# EAGLE design ascender_board (EAGLE 6.6.0)
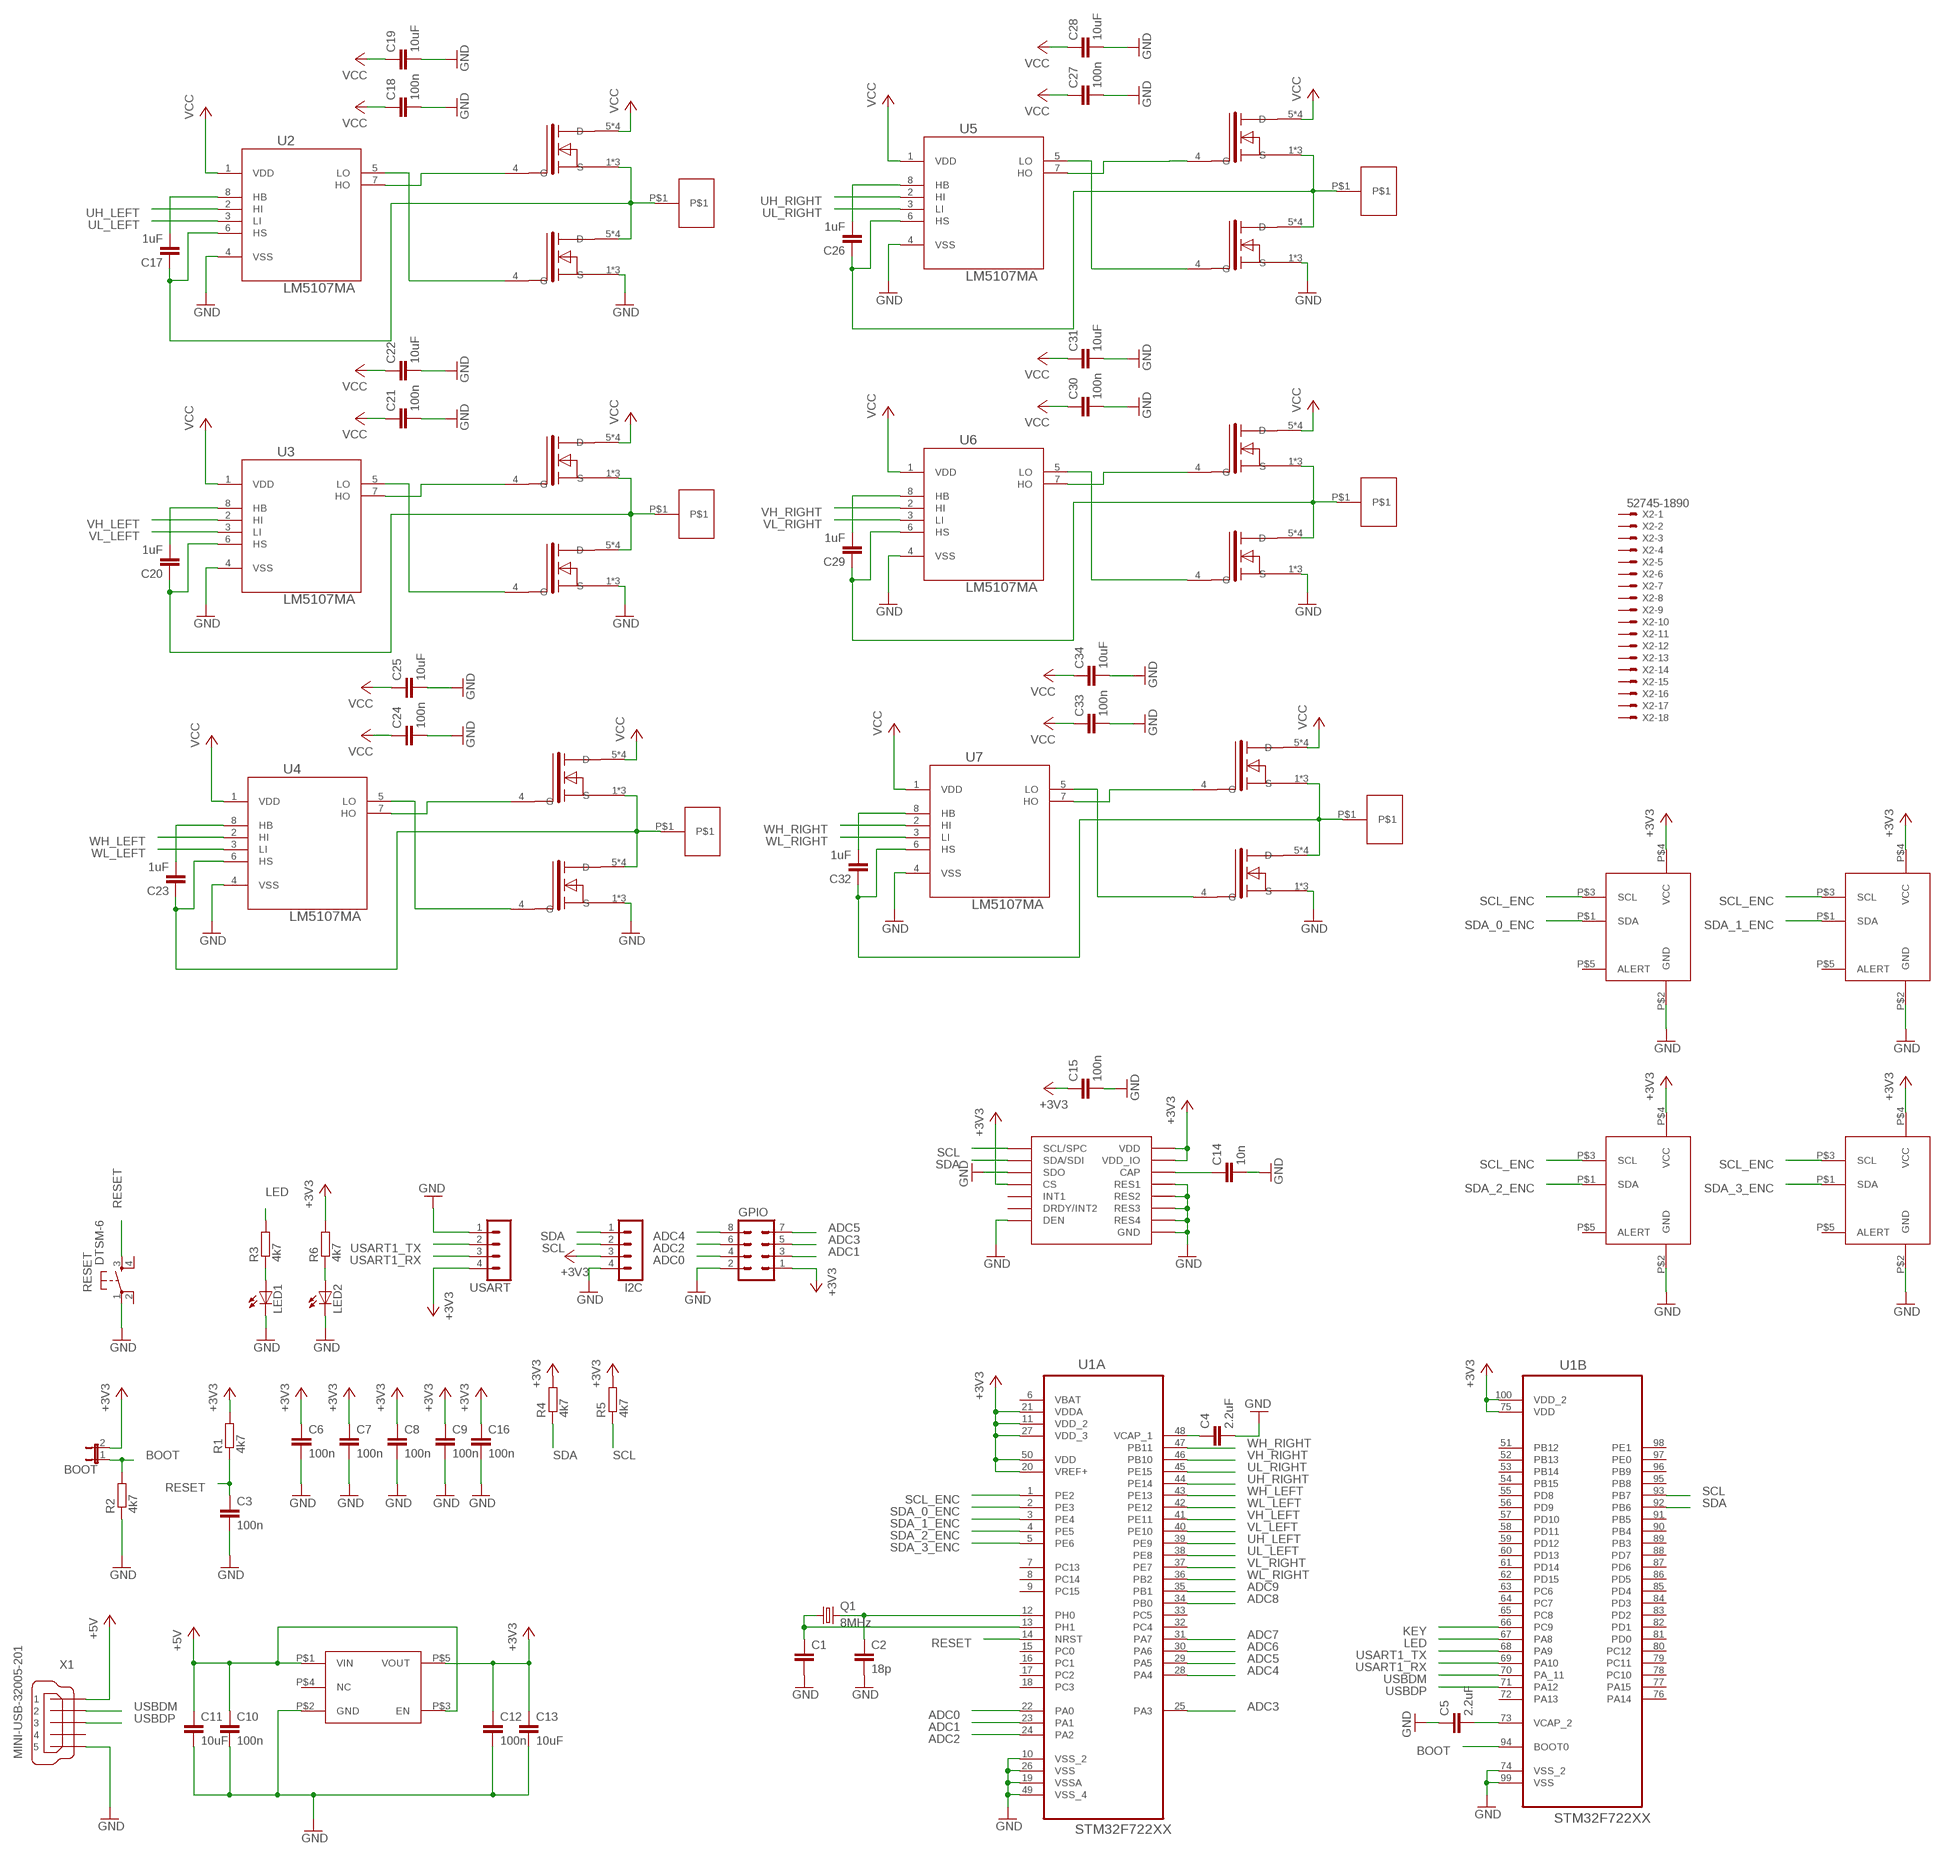
[diagram p0: schematic, sheet 1]

## Parts
BOOT  JP1E  [JP1]
C1  C-EUC0805  [C0805]
C2  18p  C-EUC0805  [C0805]
C3  100n  C-EUC0805  [C0805]
C4  2.2uF  C-EUC0805  [C0805]
C5  2.2uF  C-EUC0805  [C0805]
C6  100n  C-EUC0805  [C0805]
C7  100n  C-EUC0805  [C0805]
C8  100n  C-EUC0805  [C0805]
C9  100n  C-EUC0805  [C0805]
C10  100n  C-EUC0805  [C0805]
C11  10uF  C-EUC0805  [C0805]
C12  100n  C-EUC0805  [C0805]
C13  10uF  C-EUC0805  [C0805]
C14  10n  C-EUC0805  [C0805]
C15  100n  C-EUC0805  [C0805]
C16  100n  C-EUC0805  [C0805]
C17  1uF  C-EUC0805  [C0805]
C18  100n  C-EUC0805  [C0805]
C19  10uF  C-EUC0805  [C0805]
C20  1uF  C-EUC0805  [C0805]
C21  100n  C-EUC0805  [C0805]
C22  10uF  C-EUC0805  [C0805]
C23  1uF  C-EUC0805  [C0805]
C24  100n  C-EUC0805  [C0805]
C25  10uF  C-EUC0805  [C0805]
C26  1uF  C-EUC0805  [C0805]
C27  100n  C-EUC0805  [C0805]
C28  10uF  C-EUC0805  [C0805]
C29  1uF  C-EUC0805  [C0805]
C30  100n  C-EUC0805  [C0805]
C31  10uF  C-EUC0805  [C0805]
C32  1uF  C-EUC0805  [C0805]
C33  100n  C-EUC0805  [C0805]
C34  10uF  C-EUC0805  [C0805]
GPIO  MA04-2  [MA04-2]
I2C  MA04-1  [MA04-1]
LED1  LEDCHIPLED_1206  [CHIPLED_1206]
LED2  LEDCHIPLED_1206  [CHIPLED_1206]
Q1  8MHz  CRYSTALCTS406  [CTS406]
R1  4k7  R-EU_M0805  [M0805]
R2  4k7  R-EU_M0805  [M0805]
R3  4k7  R-EU_M0805  [M0805]
R4  4k7  R-EU_M0805  [M0805]
R5  4k7  R-EU_M0805  [M0805]
R6  4k7  R-EU_M0805  [M0805]
RESET  DTSM-6  [DTSM-6]
U1  STM32F722XX  [QFP50P1600X1600X160-100N]
U2  LM5107MA  [SOIC127P620X175-8N]
U3  LM5107MA  [SOIC127P620X175-8N]
U4  LM5107MA  [SOIC127P620X175-8N]
U5  LM5107MA  [SOIC127P620X175-8N]
U6  LM5107MA  [SOIC127P620X175-8N]
U7  LM5107MA  [SOIC127P620X175-8N]
U$1  MIC5504-3.3Y  [SOT23-5]
U$2  ST_L3GD20H  [ST_LGA16L]
U$4  IRFH7004  [PQFN5X6]
U$5  IRFH7004  [PQFN5X6]
U$6  BLDC_MOTOR_PIN  [BLDC_MOTOR_PIN]
U$7  IRFH7004  [PQFN5X6]
U$8  IRFH7004  [PQFN5X6]
U$9  BLDC_MOTOR_PIN  [BLDC_MOTOR_PIN]
U$10  IRFH7004  [PQFN5X6]
U$11  IRFH7004  [PQFN5X6]
U$12  BLDC_MOTOR_PIN  [BLDC_MOTOR_PIN]
U$13  IRFH7004  [PQFN5X6]
U$14  IRFH7004  [PQFN5X6]
U$15  BLDC_MOTOR_PIN  [BLDC_MOTOR_PIN]
U$16  IRFH7004  [PQFN5X6]
U$17  IRFH7004  [PQFN5X6]
U$18  BLDC_MOTOR_PIN  [BLDC_MOTOR_PIN]
U$19  IRFH7004  [PQFN5X6]
U$20  IRFH7004  [PQFN5X6]
U$21  BLDC_MOTOR_PIN  [BLDC_MOTOR_PIN]
U$22  SI7210  [SOT23-5]
U$23  SI7210  [SOT23-5]
U$24  SI7210  [SOT23-5]
U$25  SI7210  [SOT23-5]
USART  MA04-1  [MA04-1]
X1  MINI-USB-32005-201  [32005-201]
X2  52745-1890  [52745-1890]

## Nets
+3V3: BOOT.2 C6.1 C7.1 C8.1 C9.1 C12.1 C13.1 C15.1 C16.1 GPIO.1 I2C.3 R1.2 R4.2 R5.2 R6.2 U1.11(A:VDD_2) U1.20(A:VREF+) U1.21(A:VDDA) U1.27(A:VDD_3) U1.50(A:VDD) U1.75(B:VDD) U1.100(B:VDD_2) U$1.P$5(VOUT) U$2.P$1(VDD_IO) U$2.P$5(CS) U$2.P$16(VDD) U$22.P$4(VCC) U$23.P$4(VCC) U$24.P$4(VCC) U$25.P$4(VCC) USART.4
+5V: C10.1 C11.1 U$1.P$1(VIN) U$1.P$3(EN) X1.1
ADC0: GPIO.4 U1.22(A:PA0)
ADC1: GPIO.3 U1.23(A:PA1)
ADC2: GPIO.6 U1.24(A:PA2)
ADC3: GPIO.5 U1.25(A:PA3)
ADC4: GPIO.8 U1.28(A:PA4)
ADC5: GPIO.7 U1.29(A:PA5)
ADC6: U1.30(A:PA6)
ADC7: U1.31(A:PA7)
ADC8: U1.34(A:PB0)
ADC9: U1.35(A:PB1)
BOOT: BOOT.1 R2.2 U1.94(B:BOOT0)
GND: C1.2 C2.2 C3.2 C4.2 C5.1 C6.2 C7.2 C8.2 C9.2 C10.2 C11.2 C12.2 C13.2 C14.2 C15.2 C16.2 C18.2 C19.2 C21.2 C22.2 C24.2 C25.2 C27.2 C28.2 C30.2 C31.2 C33.2 C34.2 GPIO.2 I2C.4 LED1.C LED2.C R2.1 RESET.1 U1.10(A:VSS_2) U1.19(A:VSSA) U1.26(A:VSS) U1.49(A:VSS_4) U1.74(B:VSS_2) U1.99(B:VSS) U2.4(VSS) U3.4(VSS) U4.4(VSS) U5.4(VSS) U6.4(VSS) U7.4(VSS) U$1.P$2(GND) U$2.P$4(SDO) U$2.P$8(DEN) U$2.P$9(RES1) U$2.P$10(RES2) U$2.P$11(RES3) U$2.P$12(GND) U$2.P$13(GND) U$2.P$15(RES4) U$5.1(S) U$5.2(S) U$5.3(S) U$8.1(S) U$8.2(S) U$8.3(S) U$11.1(S) U$11.2(S) U$11.3(S) U$14.1(S) U$14.2(S) U$14.3(S) U$17.1(S) U$17.2(S) U$17.3(S) U$20.1(S) U$20.2(S) U$20.3(S) U$22.P$2(GND) U$23.P$2(GND) U$24.P$2(GND) U$25.P$2(GND) USART.1 X1.5
KEY: U1.66(B:PC9)
LED: R3.2 U1.67(B:PA8)
N$1: C2.1 Q1.3 U1.12(A:PH0)
N$2: C1.1 Q1.1 U1.13(A:PH1)
N$3: C4.1 U1.48(A:VCAP_1)
N$4: C5.2 U1.73(B:VCAP_2)
N$5: LED1.A R3.1
N$6: C14.1 U$2.P$14(CAP)
N$7: U3.5(LO) U$8.4(G)
N$9: U2.5(LO) U$5.4(G)
N$10: U2.7(HO) U$4.4(G)
N$11: LED2.A R6.1
N$14: U3.7(HO) U$7.4(G)
N$15: C17.2 U2.8(HB)
N$16: C17.1 U2.6(HS) U$4.1(S) U$4.2(S) U$4.3(S) U$5.5(D) U$5.6(D) U$5.7(D) U$5.8(D) U$6.P$1
N$18: C20.2 U3.8(HB)
N$19: C20.1 U3.6(HS) U$7.1(S) U$7.2(S) U$7.3(S) U$8.5(D) U$8.6(D) U$8.7(D) U$8.8(D) U$9.P$1
N$20: U4.5(LO) U$11.4(G)
N$22: U4.7(HO) U$10.4(G)
N$24: C23.2 U4.8(HB)
N$25: C23.1 U4.6(HS) U$10.1(S) U$10.2(S) U$10.3(S) U$11.5(D) U$11.6(D) U$11.7(D) U$11.8(D) U$12.P$1
N$27: U5.5(LO) U$14.4(G)
N$28: U5.7(HO) U$13.4(G)
N$30: C26.2 U5.8(HB)
N$31: C26.1 U5.6(HS) U$13.1(S) U$13.2(S) U$13.3(S) U$14.5(D) U$14.6(D) U$14.7(D) U$14.8(D) U$15.P$1
N$32: U6.5(LO) U$17.4(G)
N$34: U6.7(HO) U$16.4(G)
N$36: C29.2 U6.8(HB)
N$37: C29.1 U6.6(HS) U$16.1(S) U$16.2(S) U$16.3(S) U$17.5(D) U$17.6(D) U$17.7(D) U$17.8(D) U$18.P$1
N$38: U7.5(LO) U$20.4(G)
N$40: U7.7(HO) U$19.4(G)
N$42: C32.2 U7.8(HB)
N$43: C32.1 U7.6(HS) U$19.1(S) U$19.2(S) U$19.3(S) U$20.5(D) U$20.6(D) U$20.7(D) U$20.8(D) U$21.P$1
RESET: C3.1 R1.1 RESET.3 U1.14(A:NRST)
SCL: I2C.2 R5.1 U1.93(B:PB7) U$2.P$2(SCL/SPC)
SCL_ENC: U1.1(A:PE2) U$22.P$3(SCL) U$23.P$3(SCL) U$24.P$3(SCL) U$25.P$3(SCL)
SDA: I2C.1 R4.1 U1.92(B:PB6) U$2.P$3(SDA/SDI)
SDA_0_ENC: U1.2(A:PE3) U$22.P$1(SDA)
SDA_1_ENC: U1.3(A:PE4) U$23.P$1(SDA)
SDA_2_ENC: U1.4(A:PE5) U$24.P$1(SDA)
SDA_3_ENC: U1.5(A:PE6) U$25.P$1(SDA)
UH_LEFT: U1.39(A:PE9) U2.2(HI)
UH_RIGHT: U1.44(A:PE14) U5.2(HI)
UL_LEFT: U1.38(A:PE8) U2.3(LI)
UL_RIGHT: U1.45(A:PE15) U5.3(LI)
USART1_RX: U1.69(B:PA10) USART.3
USART1_TX: U1.68(B:PA9) USART.2
USBDM: U1.70(B:PA_11) X1.2
USBDP: U1.71(B:PA12) X1.3
VCC: C18.1 C19.1 C21.1 C22.1 C24.1 C25.1 C27.1 C28.1 C30.1 C31.1 C33.1 C34.1 U2.1(VDD) U3.1(VDD) U4.1(VDD) U5.1(VDD) U6.1(VDD) U7.1(VDD) U$4.5(D) U$4.6(D) U$4.7(D) U$4.8(D) U$7.5(D) U$7.6(D) U$7.7(D) U$7.8(D) U$10.5(D) U$10.6(D) U$10.7(D) U$10.8(D) U$13.5(D) U$13.6(D) U$13.7(D) U$13.8(D) U$16.5(D) U$16.6(D) U$16.7(D) U$16.8(D) U$19.5(D) U$19.6(D) U$19.7(D) U$19.8(D)
VH_LEFT: U1.41(A:PE11) U3.2(HI)
VH_RIGHT: U1.46(A:PB10) U6.2(HI)
VL_LEFT: U1.40(A:PE10) U3.3(LI)
VL_RIGHT: U1.37(A:PE7) U6.3(LI)
WH_LEFT: U1.43(A:PE13) U4.2(HI)
WH_RIGHT: U1.47(A:PB11) U7.2(HI)
WL_LEFT: U1.42(A:PE12) U4.3(LI)
WL_RIGHT: U1.36(A:PB2) U7.3(LI)
Unconnected: RESET.2 RESET.4 U1.7(A:PC13) U1.8(A:PC14) U1.9(A:PC15) U1.15(A:PC0) U1.16(A:PC1) U1.17(A:PC2) U1.18(A:PC3) U1.32(A:PC4) U1.33(A:PC5) U1.51(B:PB12) U1.52(B:PB13) U1.53(B:PB14) U1.54(B:PB15) U1.55(B:PD8) U1.56(B:PD9) U1.57(B:PD10) U1.58(B:PD11) U1.59(B:PD12) U1.60(B:PD13) U1.61(B:PD14) U1.62(B:PD15) U1.63(B:PC6) U1.64(B:PC7) U1.65(B:PC8) U1.72(B:PA13) U1.76(B:PA14) U1.77(B:PA15) U1.78(B:PC10) U1.79(B:PC11) U1.80(B:PC12) U1.81(B:PD0) U1.82(B:PD1) U1.83(B:PD2) U1.84(B:PD3) U1.85(B:PD4) U1.86(B:PD5) U1.87(B:PD6) U1.88(B:PD7) U1.89(B:PB3) U1.90(B:PB4) U1.91(B:PB5) U1.95(B:PB8) U1.96(B:PB9) U1.97(B:PE0) U1.98(B:PE1) U$1.P$4(NC) U$2.P$6(DRDY/INT2) U$2.P$7(INT1) U$22.P$5(ALERT) U$23.P$5(ALERT) U$24.P$5(ALERT) U$25.P$5(ALERT) X1.4 X2.1 X2.2 X2.3 X2.4 X2.5 X2.6 X2.7 X2.8 X2.9 X2.10 X2.11 X2.12 X2.13 X2.14 X2.15 X2.16 X2.17 X2.18

## Power pins joined to a net without a drawn wire
VBAT: U1.6(A:VBAT)

## Library data of the parts
BOOT = jumper:JP1E: JUMPER
C1-C34 = resistor:C-EU: CAPACITOR, European symbol
GPIO = con-lstb:MA04-2: PIN HEADER; OC_FARNELL: unknown; OC_NEWARK: unknown
I2C USART = con-lstb:MA04-1: PIN HEADER; OC_FARNELL: unknown; OC_NEWARK: unknown
LED1 LED2 = my_parts:LED: LED OSRAM: - CHIPLED LG R971, LG N971, LY N971, LG Q971, LY Q971, LO R971, LY R971 LH N974, LH R974 LS Q976, LO Q976, LY Q976 LO Q996 - Hyper CHIPLED LW Q18S LB Q993, LB Q99A, LB R99A - SideLED LS A670, LO A670, LY A670, LG A670, LP A670 LB A673, LV A673, LT A673, LW A673 LH A674 LY A675 LS A676, LA A676, LO A676, LY A676, LW A676 LS A679, LY A679, LG A679 - Hyper Micro SIDELED® LS Y876, LA Y876, LO Y876, LY Y876 LT Y87S - SmartLED LW L88C, LW L88S LB L89C, LB L89S, LG L890 LS L89K, LO L89K, LY L89K LS L896, LA L896, LO L896, LY L896 - TOPLED LS T670, LO T670, LY T670, LG T670, LP T670 LSG T670, LSP T670, LSY T670, LOP T670, LYG T670 LG T671, LOG T671, LSG T671 LB T673, LV T673, LT T673, LW T673 LH T674 LS T676, LA T676, LO T676, LY T676, LB T676, LH T676, LSB T676, LW T676 LB T67C, LV T67C, LT T67C, LS T67K, LO T67K, LY T67K, LW E67C LS E67B, LA E67B, LO E67B, LY E67B, LB E67C, LV E67C, LT E67C LW T67C LS T679, LY T679, LG T679 LS T770, LO T770, LY T770, LG T770, LP T770 LB T773, LV T773, LT T773, LW T773 LH T774 LS E675, LA E675, LY E675, LS T675 LS T776, LA T776, LO T776, LY T776, LB T776 LHGB T686 LT T68C, LB T68C - Hyper Mini TOPLED® LB M676 - Mini TOPLED Santana® LG M470 LS M47K, LO M47K, LY M47K Source: http://www.osram.convergy.de LUXEON: - LUMILED® LXK2-PW12-R00, LXK2-PW12-S00, LXK2-PW14-U00, LXK2-PW14-V00 LXK2-PM12-R00, LXK2-PM12-S00, LXK2-PM14-U00 LXK2-PE12-Q00, LXK2-PE12-R00, LXK2-PE12-S00, LXK2-PE14-T00, LXK2-PE14-U00 LXK2-PB12-K00, LXK2-PB12-L00, LXK2-PB12-M00, LXK2-PB14-N00, LXK2-PB14-P00, LXK2-PB14-Q00 LXK2-PR12-L00, LXK2-PR12-M00, LXK2-PR14-Q00, LXK2-PR14-R00 LXK2-PD12-Q00, LXK2-PD12-R00, LXK2-PD12-S00 LXK2-PH12-R00, LXK2-PH12-S00 LXK2-PL12-P00, LXK2-PL12-Q00, LXK2-PL12-R00 Source: www.luxeon.com KINGBRIGHT: KA-3528ASYC Source: www.kingbright.com
Q1 = crystal:CRYSTAL: CRYSTAL; OC_FARNELL: unknown; OC_NEWARK: unknown
R1-R6 = resistor:R-EU_: RESISTOR, European symbol
RESET = switch-tact:DTSM-6
U1 = stm32:STM32F722XX: IC, MCU, 32BIT, 512K FLASH, 100LQFP; MPN: STM32F407VET6; OC_FARNELL: 2064367; OC_NEWARK: 73T2332; PACKAGE: 100LQFP; SUPPLIER: STMicroelectronics
U2-U7 = my_parts:LM5107MA: Peak Half Bridge Gate Driver; MPN: LM5107MA; OC_FARNELL: 1008269; OC_NEWARK: 41K6114; PACKAGE: SOIC-8; SUPPLIER: National Semiconductors
U$1 = my_parts:MIC5504-3.3Y
U$2 = main:ST_L3GD20H
U$4 U$5 U$7 U$8 U$10 U$11 U$13 U$14 U$16 U$17 U$19 U$20 = my_parts:IRFH7004
U$6 U$9 U$12 U$15 U$18 U$21 = my_parts:BLDC_MOTOR_PIN
U$22-U$25 = my_parts:SI7210
X1 = con-cypressindustries:MINI-USB-: MINI USB-B Conector Source: www.cypressindustries.com; OC_FARNELL: unknown; OC_NEWARK: unknown
X2 = con-molex:52745-1890: FFC/FPC-to-Board 0.50mm (.020") SMT Top Contact Right Angle, ZIF, Style Receptacle 52745 / 52435 Source: http://www.molex.com/product/ffc/52745.html; MPN: 52745-1890; OC_FARNELL: unknown; OC_NEWARK: 66F4273

## Board
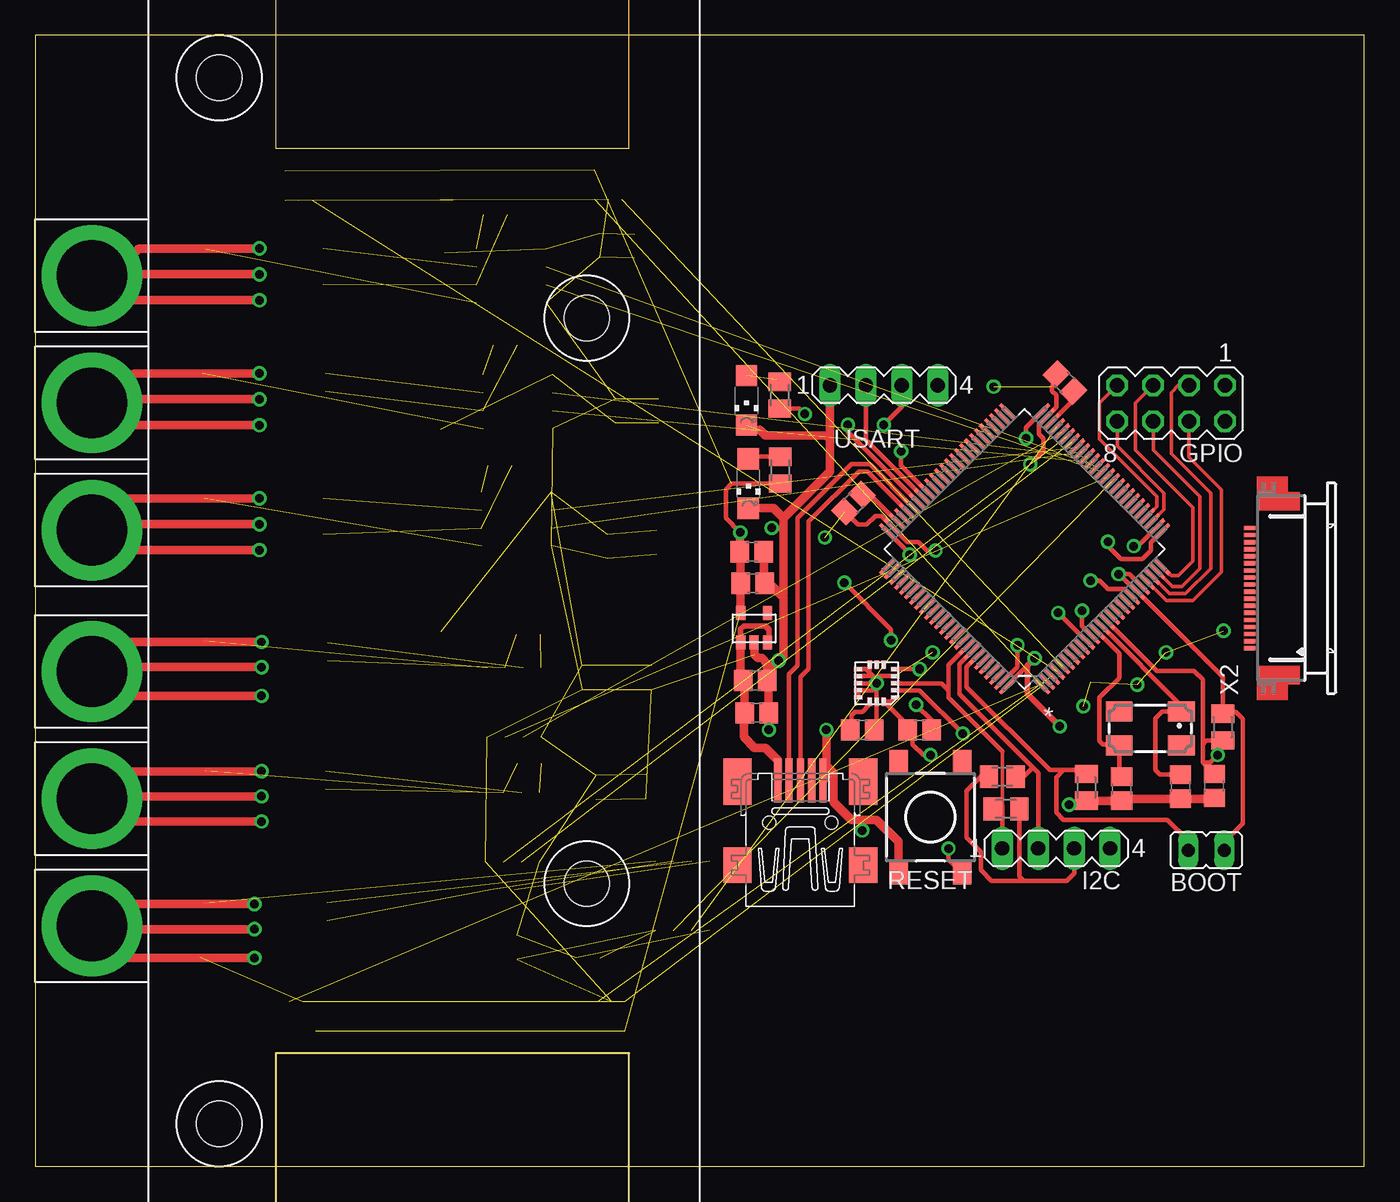
[diagram p1: board, top side]
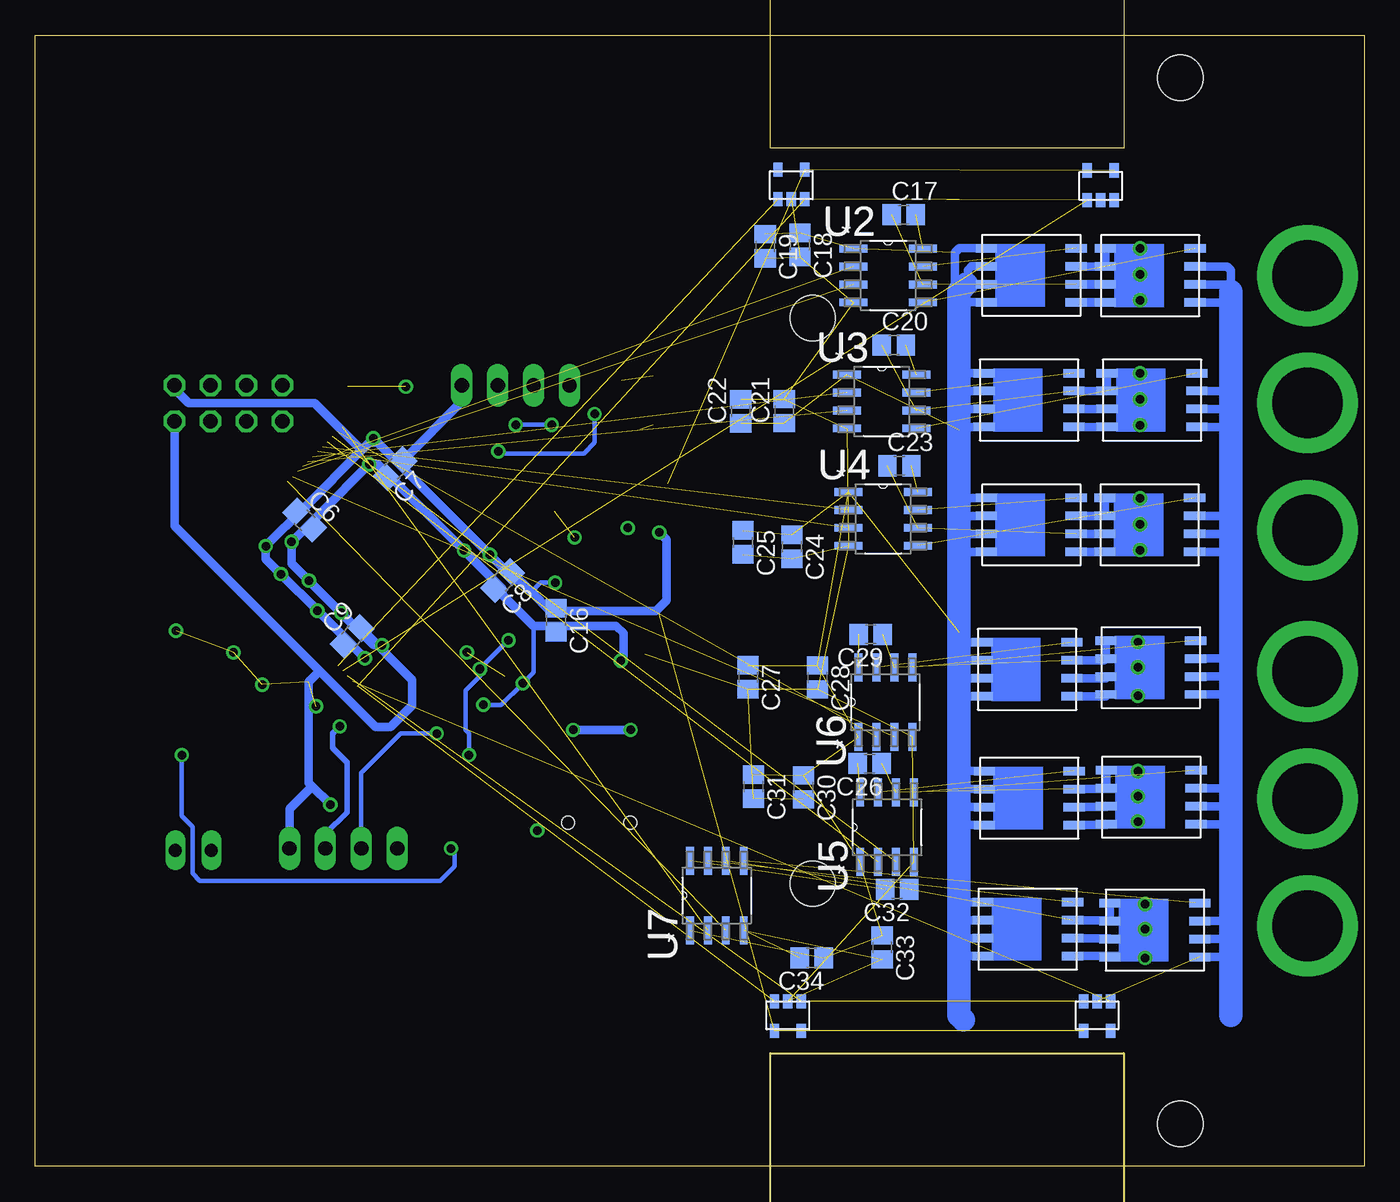
[diagram p2: board, bottom side, seen from below]

Size 94 x 80 mm. Coordinates in mm from the lower left corner, seen from the top.
Outline: 0,0 94,0 94,80 0,80 0,0
Copper layers (1*16): Top 0.035mm / dielectric 1.5mm / Bottom 0.035mm
Design rules "default": minimum track width 10mil, minimum drill 24mil, track to track 8mil, track to pad 8mil, pad to pad 8mil, via to via 8mil, smd to smd 8mil, copper to edge 40mil, drill to drill 8mil, minimum pad ring 10mil, minimum via ring 8mil, stop-mask expansion 4mil, vias tented up to drill 0mil, thermal gap 10mil

### Footprints (pad centres in the part's own frame; a part is rotated, then mirrored left to right if it is on the bottom)
JP1 = drill 0.914 long: 1 0,-1.27; 2 0,1.27
C0805 = smd 1.3 x 1.5: 1 -0.85,0; 2 0.85,0
MA04-2 = drill 1.016 octagon: 1 -3.81,-1.27; 2 -3.81,1.27; 3 -1.27,-1.27; 4 -1.27,1.27; 5 1.27,-1.27; 6 1.27,1.27; 7 3.81,-1.27; 8 3.81,1.27
MA04-1 = drill 1.016 long: 1 -3.81,0; 2 -1.27,0; 3 1.27,0; 4 3.81,0
CHIPLED_1206 = smd 1.5 x 1.5: A 0,-1.75; C 0,1.75
CTS406 = smd 1.9 x 1.4: 1 -2.2,-1.2; 2 2.2,-1.2; 3 2.2,1.2; 4 -2.2,1.2
M0805 = smd 1.3 x 1.6: 1 -0.95,0; 2 0.95,0
DTSM-6 = smd 1.55 x 1.3: 1 -3.975,2.25; 2 3.975,2.25; 3 -3.975,-2.25; 4 3.975,-2.25
QFP50P1600X1600X160-100N = smd 1.473 x 0.254: 1 -7.722,5.994; 2 -7.722,5.512; 3 -7.722,5.004; 4 -7.722,4.496; 5 -7.722,3.988; 6 -7.722,3.505; 7 -7.722,2.997; 8 -7.722,2.489; 9 -7.722,2.007; 10 -7.722,1.499; 11 -7.722,0.991; 12 -7.722,0.508; 13 -7.722,0; 14 -7.722,-0.508; 15 -7.722,-0.991; 16 -7.722,-1.499; 17 -7.722,-2.007; 18 -7.722,-2.489; 19 -7.722,-2.997; 20 -7.722,-3.505; 21 -7.722,-3.988; 22 -7.722,-4.496; 23 -7.722,-5.004; 24 -7.722,-5.512; 25 -7.722,-5.994; 51 7.722,-5.994; 52 7.722,-5.512; 53 7.722,-5.004; 54 7.722,-4.496; 55 7.722,-3.988; 56 7.722,-3.505; 57 7.722,-2.997; 58 7.722,-2.489; 59 7.722,-2.007; 60 7.722,-1.499; 61 7.722,-0.991; 62 7.722,-0.508; 63 7.722,0; 64 7.722,0.508; 65 7.722,0.991; 66 7.722,1.499; 67 7.722,2.007; 68 7.722,2.489; 69 7.722,2.997; 70 7.722,3.505; 71 7.722,3.988; 72 7.722,4.496; 73 7.722,5.004; 74 7.722,5.512; 75 7.722,5.994 | smd 0.254 x 1.473: 26 -5.994,-7.722; 27 -5.512,-7.722; 28 -5.004,-7.722; 29 -4.496,-7.722; 30 -3.988,-7.722; 31 -3.505,-7.722; 32 -2.997,-7.722; 33 -2.489,-7.722; 34 -2.007,-7.722; 35 -1.499,-7.722; 36 -0.991,-7.722; 37 -0.508,-7.722; 38 0,-7.722; 39 0.508,-7.722; 40 0.991,-7.722; 41 1.499,-7.722; 42 2.007,-7.722; 43 2.489,-7.722; 44 2.997,-7.722; 45 3.505,-7.722; 46 3.988,-7.722; 47 4.496,-7.722; 48 5.004,-7.722; 49 5.512,-7.722; 50 5.994,-7.722; 76 5.994,7.722; 77 5.512,7.722; 78 5.004,7.722; 79 4.496,7.722; 80 3.988,7.722; 81 3.505,7.722; 82 2.997,7.722; 83 2.489,7.722; 84 2.007,7.722; 85 1.499,7.722; 86 0.991,7.722; 87 0.508,7.722; 88 0,7.722; 89 -0.508,7.722; 90 -0.991,7.722; 91 -1.499,7.722; 92 -2.007,7.722; 93 -2.489,7.722; 94 -2.997,7.722; 95 -3.505,7.722; 96 -3.988,7.722; 97 -4.496,7.722; 98 -5.004,7.722; 99 -5.512,7.722; 100 -5.994,7.722
SOIC127P620X175-8N = smd 1.981 x 0.559: 1 -2.464,1.905; 2 -2.464,0.635; 3 -2.464,-0.635; 4 -2.464,-1.905; 5 2.464,-1.905; 6 2.464,-0.635; 7 2.464,0.635; 8 2.464,1.905
SOT23-5 = smd 0.66 x 1: P$1 0.95,1; P$2 0,1; P$3 -0.95,1; P$4 -0.95,-1.1; P$5 0.95,-1.1
ST_LGA16L = smd 0.6 x 0.3: P$1 -1.3,1; P$2 -1.3,0.5; P$3 -1.3,0; P$4 -1.3,-0.5; P$5 -1.3,-1; P$9 1.3,-1; P$10 1.3,-0.5; P$11 1.3,0; P$12 1.3,0.5; P$13 1.3,1 | smd 0.3 x 0.6: P$6 -0.5,-1.3; P$7 0,-1.3; P$8 0.5,-1.3; P$14 0.5,1.3; P$15 0,1.3; P$16 -0.5,1.3
BLDC_MOTOR_HOLDER = hole 3.2: -37,14; 37,14; -20,-12; 20,-12
PQFN5X6 = smd 0.6 x 1.5: 1 0,0; 2 1.27,0; 3 2.54,0; 4 3.81,0; 5 0,6.35; 6 1.27,6.35; 7 2.54,6.35; 8 3.81,6.35
BLDC_MOTOR_PIN = drill 5 pad 7.112: P$1 0,0
32005-201 = smd 3.1 x 0.5: 1 3,1.6; 2 3,0.8; 3 3,0; 4 3,-0.8; 5 3,-1.6 | smd 2.5 x 2: M1 -3,-4.45; M2 -3,4.45 | smd 3.3 x 2: M3 2.9,4.45; M4 2.9,-4.45 | hole 0.9: 0,2.2; 0,-2.2
52745-1890 = smd 0.3 x 0.8: 1 -4.25,2.5; 2 -3.75,2.5; 3 -3.25,2.5; 4 -2.75,2.5; 5 -2.25,2.5; 6 -1.75,2.5; 7 -1.25,2.5; 8 -0.75,2.5; 9 -0.25,2.5; 10 0.25,2.5; 11 0.75,2.5; 12 1.25,2.5; 13 1.75,2.5; 14 2.25,2.5; 15 2.75,2.5; 16 3.25,2.5; 17 3.75,2.5; 18 4.25,2.5

### Placement (x,y rotation side)
BOOT  82.83,22.35 270 top
C1  81,26.85 270 top
C2  76.84,26.7 270 top
C3  83.39,26.9 270 top
C4  72.82,55.45 135 top
C5  57.89,46.91 45 top
C6  74.96,45.7 315 bottom
C7  68.56,49.35 225 bottom
C8  60.94,41.43 225 bottom
C9  71.6,37.47 45 bottom
C10  50.92,34.36 0 top
C11  51.02,32.07 0 top
C12  50.74,41.24 0 top
C13  50.69,43.47 0 top
C14  58.5,30.86 0 top
C15  62.56,30.86 0 top
C16  57.17,38.62 270 bottom
C17  32.57,67.3 0 bottom
C18  39.91,65.17 270 bottom
C19  42.37,65.08 270 bottom
C20  33.27,58.09 0 bottom
C21  41.03,53.42 90 bottom
C22  44.09,53.41 90 bottom
C23  32.87,49.55 0 bottom
C24  40.48,43.83 270 bottom
C25  43.94,44.13 270 bottom
C26  34.98,28.48 180 bottom
C27  43.58,34.59 270 bottom
C28  38.67,34.57 270 bottom
C29  34.9,37.62 180 bottom
C30  39.66,26.79 270 bottom
C31  43.2,26.86 270 bottom
C32  33.04,19.59 180 bottom
C33  34.09,15.48 270 bottom
C34  39.09,14.73 180 bottom
GPIO  80.34,53.98 180 top
I2C  72.21,22.48 0 top
LED1  50.31,54.18 180 top
LED2  50.43,48.3 180 top
Q1  78.87,30.96 180 top
R1  84,31.07 90 top
R2  74.35,26.8 90 top
R3  52.67,54.55 270 top
R4  68.66,25.27 0 top
R5  68.4,27.56 180 top
R6  52.7,49.24 270 top
RESET  63.32,24.7 90 top
U1  69.98,43.66 135 top
U2  33.67,63.01 0 bottom
U3  34.13,54.1 0 bottom
U4  34.03,45.8 0 bottom
U5  33.75,23.98 90 bottom
U6  33.87,32.83 90 bottom
U7  45.79,19.15 90 bottom
U$1  50.84,38.04 180 top
U$2  59.51,34.16 180 top
U$3  [BLDC_MOTOR_HOLDER]  27,40 90 top
U$4  20.37,61.12 90 bottom
U$5  11.97,61.1 90 bottom
U$6  4,63 0 top
U$7  20.53,52.29 90 bottom
U$8  11.84,52.29 90 bottom
U$9  4,54 90 top
U$10  20.37,43.47 90 bottom
U$11  12,43.47 90 bottom
U$12  4,45 0 top
U$13  20.52,24.14 90 bottom
U$14  11.89,24.2 90 bottom
U$15  4,26 90 top
U$16  20.67,33.24 90 bottom
U$17  11.92,33.37 90 bottom
U$18  4,35 90 top
U$19  20.62,14.86 90 bottom
U$20  11.63,14.8 90 bottom
U$21  4,17 90 top
U$22  18.89,10.67 0 bottom
U$23  40.77,10.67 0 bottom
U$24  18.64,69.34 180 bottom
U$25  40.52,69.4 180 bottom
USART  60.02,55.25 0 top
X1  54.12,24.3 90 top
X2  88.39,40.89 90 top

### Tracks (layer width: path | path; a pad name or v marks a point on that pad's centre or on a via)
+3V3  (via drill 0.6)  (4 unrouted)
  Top 0.305: U1.100 68.76,34.01 v70.69,35.94 69.78,35.03 | v70.08,51.49 70.08,52.24 U1.50 | v77.7,43.87 77.98,43.87 U1.27 | v74.04,39.3 74.04,38.2 U1.11 | U1.21 77.4,41.89 v76.63,41.89 77.84,40.68 U1.20 84,34.6 R1.2 84.12,32.13 84.91,32.13 85.42,31.62 85.42,24.26 84.1,22.94 BOOT.2 | v61.85,43.26 61.85,43.31 U1.75 | R6.2 49.26,48.29 48.85,47.88 48.85,45.85 v49.86,44.83 | R4.2 69.61,20.51 69.93,20.19 | 69.93,20.19 72.98,20.19 73.48,20.7 I2C.3 | R5.2 66.88,27.56 65.86,26.54 65.86,23.24 66.88,22.23 66.88,20.96 67.64,20.19 69.93,20.19 | U$2.P$1 60.51,32.86 U$2.P$16 61.71,31.17 C15.1 62.05,30.52 62.05,29.85 62.82,29.08 v63.32,29.08 | U$2.P$5 v62.55,35.16 v62.56,35.18 | v60.53,37.21 60.53,37.97 v57.23,41.28
  Top 0.406: v72.47,31.12 70.18,33.4 70.18,35.43 v70.69,35.94
  Top 0.61: U$1.P$5 C12.1 49.89,43.42 C13.1 49.86,43.5 v49.86,44.83
  Bottom 0.305: 70.39,51.18 v70.08,51.49 | C7.1 68.26,49.67 68.86,50.27 | C6.1 75.27,46.3 74.96,46.61 | C9.1 72.2,37.17 72.06,37.31 | C8.1 60.48,41.89 | C16.1 56.66,39.47 56.47,39.28 | v63.32,29.08 63.32,30.61 63.58,30.86 63.58,33.66 62.55,34.69 v62.55,35.16 | v62.56,35.18 v60.53,37.21 | v57.23,41.28 58.24,41.28 58.91,40.61
  Bottom 0.406: I2C.3 73.48,23.5 71.96,25.02 71.96,28.58 72.98,29.59 72.98,30.61 v72.47,31.12
  Bottom 0.61: v70.69,35.94 72.06,37.31 v74.04,39.3 v76.63,41.89 77.7,42.95 v77.7,43.87 74.96,46.61 70.92,50.65 | 70.92,50.65 70.39,51.18 69.78,51.18 68.86,50.27 v61.85,43.26 60.48,41.89 60.02,41.43 | C8.1 58.91,40.61 57.58,39.28 56.47,39.28 50.08,39.28 49.35,40.01 49.35,44.32 v49.86,44.83 | GPIO.1 84.15,54.99 83.14,53.98 74.25,53.98 70.92,50.65 | USART.4 63.83,54.08 C7.1
+5V
  Top 0.406: U$1.P$1 49.89,38 50.12,38.23 51.64,38.23 51.89,37.97 51.89,37.14 U$1.P$3
  Top 0.61: X1.1 52.52,28.71 51.64,29.59 50.88,29.59 50.12,30.35 50.12,32.02 C11.1 50.17,34.25 C10.1 49.89,34.53 U$1.P$1
ADC0
  Top 0.254: GPIO.4 81.61,50.17 83.9,47.88 83.9,42.04 81.87,40.01 79.99,40.01 U1.22
ADC1
  Top 0.254: GPIO.3 80.85,55.25 80.34,54.74 80.34,50.42 83.14,47.63 83.14,42.29 81.36,40.51 80.2,40.51 U1.23
ADC2
  Top 0.254: GPIO.6 79.07,50.67 82.37,47.37 82.37,42.29 81.1,41.02 80.42,41.02 U1.24
ADC3
  Top 0.254: U1.25 80.34,41.78 80.85,41.78 81.87,42.8 81.87,46.61 77.8,50.67 77.8,53.98 GPIO.5
  Top 0.305: 80.23,41.89 U1.25
ADC4
  Top 0.254: GPIO.8 76.53,50.93 79.83,47.63 79.83,46.44 U1.28
ADC5
  Top 0.254: GPIO.7 75.26,53.98 75.26,51.44 79.33,47.37 79.33,46.65 U1.29
BOOT
  Top 0.305: 72.72,28.02 74.08,28.02 R2.2 | BOOT.1 81.56,23.04 80.09,24.51 72.72,24.51 72.21,25.02 72.21,27.51 72.72,28.02 | 72.72,28.02 71.76,28.02 65.86,33.91 65.86,35.31 U1.94
GND  (via drill 0.6)  (31 unrouted)
  Top 0.305: 76.99,26 C2.2 | 77.56,40.35 U1.19 77.06,40.82 75.87,40.82 75.26,41.43 v74.65,41.43 | U1.10 74.36,37.14 v72.37,39.14 | U1.99 68.44,34.31 69.47,35.33 v69.47,36.86 | v70.39,49.66 71.3,50.57 71.3,51.49 71,51.79 71,52.47 U1.49 72.21,53.69 72.21,54.53 71.91,54.84 71.91,55.14 72.22,55.46 C4.2 | v75.87,44.17 75.87,43.87 76.79,42.95 78.31,42.95 78.92,43.56 78.92,44.13 U1.26 | v63.68,43.56 63.07,43.56 62.46,44.17 61.68,44.17 U1.74 | 60.15,45.7 U1.74 | C5.1 57.29,46.3 58.19,45.39 58.8,45.39 59.41,46 59.85,46 U1.74 | v52.09,45.15 52.59,45.15 52.91,44.83 | v58.5,23.75 58.5,24.51 | U$2.P$4 59.76,34.66 59.51,34.42 | U$2.P$8 59.01,34.92 | 59.01,34.92 59.27,34.66 | U$2.P$9 58.77,35.16 59.01,34.92 | U$2.P$10 59.27,34.66 | 59.27,34.66 59.39,34.55 | U$2.P$11 59.01,34.16 59.39,34.55 | U$2.P$13 U$2.P$12 59.27,33.66 59.51,33.91 | 59.51,33.91 U$2.P$15 59.51,31.03 C14.2 | 59.51,33.91 v59.51,34.16 59.51,34.42 | C15.2 63.41,31.54 v62.31,32.64 | 59.51,34.42 59.39,34.55
  Top 0.61: 80.74,25.73 C1.2 | v73.13,25.58 74.08,25.58 R2.1 C2.2 | 76.99,26 C1.2 | C1.2 83.34,26 C3.2 | 51.77,34.93 C10.2 51.87,34.25 C11.2 51.87,30.89 v51.89,30.86 | 51.77,34.93 51.77,35.56 51.39,35.94 51.13,35.94 50.88,36.2 50.88,37 U$1.P$2 | 52.78,40.39 51.93,41.24 C12.2 51.54,41.29 C13.2 | 52.78,40.39 52.91,40.26 52.91,36.07 v52.59,35.75 51.77,34.93 | v55.96,30.86 55.96,28.32 | 55.96,28.32 55.96,27.54 X1.5 | USART.1 56.21,51.44 | 56.21,51.44 56.21,49.15 52.91,45.85 | 52.91,45.85 52.91,44.83 52.91,40.51 52.78,40.39 | LED2.C 52.21,46.55 52.91,45.85 | 51.22,52.11 51.64,51.69 55.96,51.69 56.21,51.44 | RESET.1 61.07,22.96 59.51,24.51 58.5,24.51 57.74,24.51 56.47,25.78 56.47,27.81 55.96,28.32
  Bottom 0.305: 75.87,42.65 v74.65,41.43 | C7.2 69.46,48.75 69.17,49.05 | C6.2 74.36,45.69 73.89,46.15 | C9.2 71.29,38.07 71.45,38.23 | C8.2 60.95,40.83 60.94,40.82 | C16.2 56.92,37.77 56.47,38.23 | v62.31,32.64 61.04,32.64 v59.51,34.16 58.75,34.93 58.75,38.23
  Bottom 0.61: v69.47,36.86 70.08,36.86 71.45,38.23 v72.37,39.14 75.87,42.65 v75.87,44.17 73.89,46.15 v70.39,49.66 69.78,49.66 69.17,49.05 v63.68,43.56 60.94,40.82 60.94,40.41 58.75,38.23 56.47,38.23 52.91,38.23 52.4,37.72 52.4,35.94 v52.59,35.75 | 74.42,26.87 74.65,27.1 74.65,34.27 73.89,35.03 | 74.42,26.87 v73.13,25.58 | C9.2 67.34,34.4 67.34,32.59 68.86,31.07 69.93,31.07 73.89,35.03 | GPIO.2 84.15,45.29 73.89,35.03 | v55.96,30.86 v51.89,30.86 | I2C.4 76.02,25.27 74.42,26.87 | U$5.3 9.69,63.64 9.45,63.4 9.45,62.18 | 9.45,62.18 9.45,60.96 9.59,61.1 U$5.1 | U$8.1 9.58,52.29 9.45,52.43 | U$8.2 9.53,53.56 9.45,53.65 | U$8.3 9.48,54.83 9.45,54.86 | U$5.2 9.64,62.37 9.45,62.18 | U$11.1 9.57,43.47 9.45,43.59 | U$11.2 9.82,44.74 9.45,45.11 | U$11.3 9.47,46.01 9.45,46.02 | 9.48,36.54 9.45,36.58 | 9.84,35.27 9.45,35.66 | 9.62,34 9.45,33.83 | 9.55,33.12 9.45,33.22 | 9.45,34.44 9.5,34.39 9.5,34.64 U$17.2 | 9.76,35.66 9.45,35.97 | U$17.3 9.45,35.91 9.45,35.81 | U$17.1 9.45,33.37 9.45,33.53 | U$14.3 9.45,26.74 9.45,26.67 | U$14.1 9.45,24.2 9.45,24.38 | U$14.2 9.45,25.47 9.45,25.4 | U$20.1 9.45,14.8 9.45,14.99 | U$20.2 9.45,16.07 9.45,16.26 | U$20.3 9.45,17.34 9.45,17.78
  Bottom 1.676: 9.45,61.87 9.45,60.96 9.45,54.86 9.45,53.65 9.45,52.43 9.45,46.02 9.45,45.11 9.45,43.59 9.45,36.58 9.45,35.97 9.45,35.81 9.45,35.66 9.45,34.44 9.45,33.83 9.45,33.53 9.45,33.22 9.45,26.67 9.45,25.4 9.45,24.38 9.45,17.78 9.45,16.26 9.45,14.99 9.45,10.67
  other vias: 84.05,37.87 79.99,36.35 77.95,34.06 74.14,32.54 63.48,36.35 55.86,44.48 67.79,55.14
LED  (via drill 0.6)
  Top 0.305: v61.24,50.57 61.24,49.56 U1.67 | R3.2 54.05,53.6 v54.43,53.21
  Bottom 0.305: v54.43,53.21 54.43,51.18 55.2,50.42 61.09,50.42 v61.24,50.57
N$1
  Top 0.305: U1.12 76.67,36.26 76.67,34.55 75.26,33.15 75.26,30.1 75.52,29.85 76.59,29.85 Q1.3 76.67,27.71 C2.1
N$2
  Top 0.305: U1.13 81.07,32.57 Q1.1 79.71,32.16 79.22,31.68 79.22,28.02 79.53,27.71 80.99,27.71 C1.1
N$3
  Top 0.305: C4.1 73.42,54.19 U1.48
N$4
  Top 0.305: C5.2 59.05,47.52 U1.73
N$5  (1 unrouted)
  Top 0.305: 52.55,55.61 R3.1
N$6
  Top 0.305: U$2.P$14 59.01,32.65 58.5,32.13 57.99,32.13 57.74,31.88 57.74,30.95 C14.1
N$7  (1 unrouted)
N$9  (1 unrouted)
N$10  (1 unrouted)
N$11
  Top 0.305: R6.1 50.57,50.19 LED2.A
N$14  (1 unrouted)
N$15  (1 unrouted)
N$16  (via drill 0.6)  (2 unrouted)
  Top 0.61: v15.85,64.92 7.32,64.92 5.39,63 U$6.P$1 5.74,61.27 v15.85,61.27 | v15.85,63.09 3.96,63.09
  Bottom 0.61: U$5.5 20.35,61.1 U$4.1 15.99,61.12 v15.85,61.27 | U$5.6 20.35,62.37 U$4.2 16.55,62.39 v15.85,63.09 16.4,63.64 U$5.7 | U$5.7 20.35,63.64 U$4.3 | U$5.7 U$5.8 18.31,64.92 v15.85,64.92
N$18  (1 unrouted)
N$19  (via drill 0.6)  (2 unrouted)
  Top 0.61: U$9.P$1 4.93,54 7.01,56.08 v15.85,56.08 | v15.85,54.25 4.57,54.25 4.27,53.95 | 4.27,53.95 3.96,53.95 | 4.27,53.95 4.88,53.95 6.4,52.43 v15.85,52.43
  Bottom 0.61: U$7.1 U$8.5 15.98,52.29 v15.85,52.43 | U$8.6 U$7.2 16.54,53.56 v15.85,54.25 16.43,54.83 U$7.3 U$8.7 U$8.8 18.16,56.08 v15.85,56.08
N$20  (1 unrouted)
N$22  (1 unrouted)
N$24  (1 unrouted)
N$25  (via drill 0.6)  (2 unrouted)
  Top 0.61: 4.57,45.41 6.4,47.24 v15.85,47.24 | v15.85,45.41 4.57,45.41 | 4.57,45.41 4.16,45 U$12.P$1 5.41,43.59 v15.85,43.59
  Bottom 0.61: U$11.5 U$10.1 15.97,43.47 v15.85,43.59 | U$11.6 U$10.2 16.53,44.74 v15.85,45.41 16.44,46.01 U$10.3 U$11.7 U$11.8 18.31,47.24 v15.85,47.24
N$27  (1 unrouted)
  Bottom 0.61: U$14.4 12.02,28.01
N$28  (1 unrouted)
N$30  (1 unrouted)
N$31  (via drill 0.6)  (2 unrouted)
  Top 0.61: v16,27.94 5.94,27.94 U$15.P$1 | v16,26.16 4.16,26.16 U$15.P$1 | v16,24.38 5.62,24.38 U$15.P$1
  Bottom 0.61: U$13.1 18.24,24.14 U$14.5 16.19,24.2 v16,24.38 | U$13.2 18.24,25.41 U$14.6 16.7,25.47 v16,26.16 | U$13.3 18.24,26.68 | 18.24,26.68 U$14.7 U$14.8 | 18.24,26.68 17.26,26.68 v16,27.94
N$32  (1 unrouted)
N$34  (1 unrouted)
N$36  (1 unrouted)
N$37  (via drill 0.6)  (2 unrouted)
  Top 0.61: 4.46,34.54 U$18.P$1 | v16,33.27 5.73,33.27 U$18.P$1 | v16,37.08 6.08,37.08 4.44,35.44 | 4.44,35.44 U$18.P$1 | v16,35.31 4.57,35.31 4.44,35.44
  Bottom 0.61: U$16.1 18.27,33.24 U$17.5 16.1,33.37 v16,33.27 | U$16.2 18.27,34.51 U$17.6 16.67,34.64 | U$17.8 U$17.7 | 16,34.54 16.1,34.64 16.67,34.64 | U$17.7 17.18,35.91 v16,37.08 | 16.67,34.64 v16,35.31 | U$16.3 18.4,35.78 U$17.7
N$38  (1 unrouted)
  Bottom 0.61: U$20.4 11.94,18.61
N$40  (1 unrouted)
N$42  (1 unrouted)
N$43  (via drill 0.6)  (2 unrouted)
  Top 0.61: v15.49,14.73 6.27,14.73 U$21.P$1 | v15.49,16.76 4.24,16.76 U$21.P$1 | v15.49,18.54 5.54,18.54 U$21.P$1
  Bottom 0.61: U$19.1 17.98,14.86 | 17.98,14.86 U$20.5 | U$19.2 17.98,16.13 U$20.6 16.19,16.07 v15.49,16.76 | U$19.3 17.98,17.4 U$20.7 | U$20.8 U$20.7 | 17.98,14.86 15.63,14.86 v15.49,14.73 | U$20.7 16.69,17.34 v15.49,18.54
RESET  (via drill 0.6)
  Top 0.305: U1.14 79.33,35.03 81.97,35.03 82.58,34.42 82.58,29.85 | 82.58,29.85 82.58,28.56 | 82.58,28.56 C3.1 | R1.1 82.85,30.11 82.58,29.85 | 82.58,28.56 83.12,28.56 v83.64,29.08 | v64.59,22.48 64.59,21.69 RESET.3
  Bottom 0.305: v83.64,29.08 83.64,24.77 82.88,24 82.88,20.7 82.37,20.19 65.36,20.19 64.34,21.21 64.34,22.23 v64.59,22.48
SCL  (via drill 0.6)
  Top 0.305: I2C.2 70.94,27.81 70.56,28.2 | 70.56,28.2 65.36,33.4 65.36,35.52 U1.93 | R5.1 69.93,27.56 70.56,28.2 | U$2.P$2 62.55,33.66 v65.61,30.61
  Bottom 0.305: v65.61,30.61 68.15,30.61 70.94,27.81 I2C.2
SCL_ENC  (4 unrouted)
SDA
  Top 0.254: 68.4,29.34 68.4,25.53
  Top 0.305: I2C.1 68.4,25.53 68.15,25.27 R4.1 | 68.4,29.34 64.59,33.15 64.59,33.66 | 64.59,33.66 64.59,35.44 U1.92 | U$2.P$3 64.09,34.16 64.59,33.66
SDA_0_ENC  (1 unrouted)
SDA_1_ENC  (1 unrouted)
SDA_2_ENC  (1 unrouted)
SDA_3_ENC  (1 unrouted)
UH_LEFT  (1 unrouted)
UH_RIGHT  (1 unrouted)
UL_LEFT  (1 unrouted)
UL_RIGHT  (1 unrouted)
USART1_RX  (via drill 0.6)
  Top 0.305: USART.3 61.29,53.72 v60.02,52.45 | v57.48,52.45 57.48,51.92 U1.69
  Bottom 0.305: v60.02,52.45 v57.48,52.45
USART1_TX
  Top 0.305: USART.2 58.75,51.37 U1.68
USBDM
  Top 0.305: U1.70 59.03,49.66 57.74,49.66 53.93,45.85 53.93,35.43 53.32,34.83 X1.2
USBDP
  Top 0.305: X1.3 54.12,34.61 54.69,35.18 54.69,45.59 58.24,49.15 58.85,49.15 U1.71
VCC  (18 unrouted)
  Bottom 0.61: 28.04,62.48 28.13,62.39 | U$4.8 28.64,64.93 28.96,64.62 28.96,61.57 | 28.96,61.57 28.65,61.27 | U$4.5 28.49,61.12 28.65,60.96 | U$7.5 28.48,52.29 28.65,52.12 | U$7.6 28.57,53.56 28.65,53.65 | U$7.7 28.62,54.83 28.65,54.86 | U$7.8 28.63,56.1 28.65,56.08 | U$10.8 28.38,47.28 28.65,47.55 | U$10.7 28.63,46.01 28.65,46.02 | U$10.6 28.58,44.74 28.65,44.81 | U$10.5 28.53,43.47 28.65,43.59 | U$4.7 27.78,63.66 28.04,63.4 28.04,62.48 | 28.35,62.18 28.96,61.57 | U$4.6 27.95,62.39 28.04,62.48 | 28.57,37.71 28.65,37.8 | 28.52,36.44 28.65,36.58 | 28.47,35.17 28.65,35.36 | 28.58,33.9 28.65,33.83 | 28.57,36.8 28.65,36.88 | 28.65,35.66 28.52,35.53 28.27,35.78 U$16.7 | 28.53,34.26 28.65,34.14 | 28.58,32.99 28.65,32.92 | U$16.8 28.62,37.05 28.65,37.08 | U$16.6 28.62,34.51 28.65,34.54 | 28.65,33.27 28.62,33.24 U$16.5 28.67,33.24 28.7,33.27 | U$13.8 28.64,27.95 28.65,27.94 | U$13.7 28.64,26.68 28.65,26.67 | U$13.6 28.64,25.41 28.65,25.4 | U$13.5 28.64,24.14 28.65,24.13 | U$19.8 28.53,18.67 28.65,18.8 | U$19.7 28.52,17.4 28.65,17.27 | U$19.6 28.52,16.13 28.65,16 | U$19.5 28.52,14.86 28.65,14.73
  Bottom 1.676: 28.13,62.39 28.35,62.18 28.65,61.87 28.65,61.27 28.65,60.96 28.65,56.08 28.65,54.86 28.65,53.65 28.65,52.12 28.65,47.55 28.65,46.02 28.65,44.81 28.65,43.59 28.65,37.8 28.65,37.08 28.65,36.88 28.65,36.58 28.65,35.66 28.65,35.36 28.65,34.54 28.65,34.14 28.65,33.83 28.65,33.27 28.65,32.92 28.65,27.94 28.65,26.67 28.65,25.4 28.65,24.13 28.65,18.8 28.65,17.27 28.65,16 28.65,14.73 28.65,10.67 28.35,10.36
VH_LEFT  (1 unrouted)
VH_RIGHT  (1 unrouted)
VL_LEFT  (1 unrouted)
VL_RIGHT  (1 unrouted)
WH_LEFT  (1 unrouted)
WH_RIGHT  (1 unrouted)
WL_LEFT  (1 unrouted)
WL_RIGHT  (1 unrouted)